# EAGLE design drl (EAGLE 6.5.0)
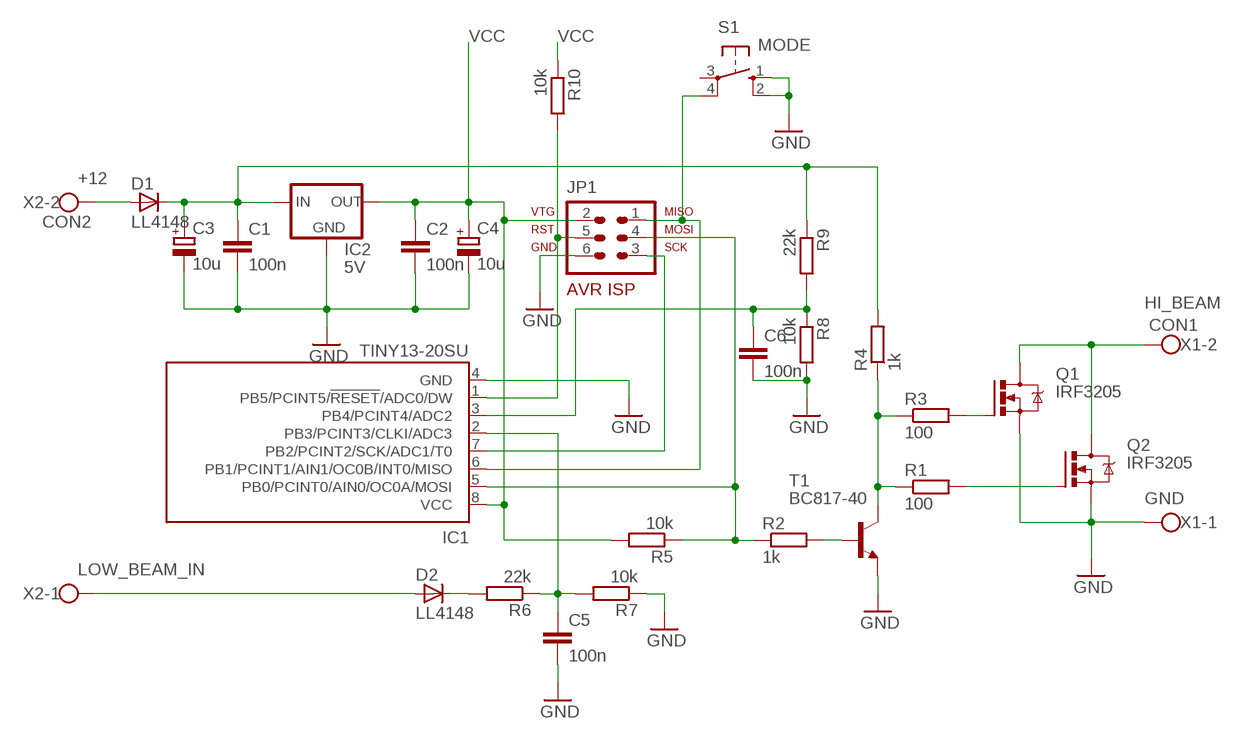
[diagram p0: schematic, sheet 1]

## Parts
C1  100n  C-EUC0805K  [C0805K]
C2  100n  C-EUC0805K  [C0805K]
C3  10u  CPOL-EUSMCD  [SMC_D]
C4  10u  CPOL-EUSMCD  [SMC_D]
C5  100n  C-EUC0805K  [C0805K]
C6  100n  C-EUC0805K  [C0805K]
D1  LL4148  D-SOD-80  [SOD80]
D2  LL4148  D-SOD-80  [SOD80]
IC1  TINY13-20SU  [8S2]
IC2  5V  UA78L05SOIC  [SOIC8]
JP1  AVR-ISP-6  [AVR-ISP-6]
Q1  IRF3205  [TO220BV]
Q2  IRF3205  [TO220BV]
R1  100  R-EU_R0805  [R0805]
R2  1k  R-EU_0204/7  [0204/7]
R3  100  R-EU_R0805  [R0805]
R4  1k  R-EU_R0805  [R0805]
R5  10k  R-EU_R0805  [R0805]
R6  22k  R-EU_R0805  [R0805]
R7  10k  R-EU_R0805  [R0805]
R8  10k  R-EU_R0805  [R0805]
R9  22k  R-EU_R0805  [R0805]
R10  10k  R-EU_R0805  [R0805]
S1  MODE  10-XX  [B3F-10XX]
T1  BC817-40  BC817-40-NPN-SOT23-BEC  [SOT23-BEC]
X1  CON1  W237-102  [W237-102]
X2  CON2  W237-102  [W237-102]

## Nets
+12: D1.2(A) X2.2
GND: C1.2 C2.2 C3.- C4.- C5.2 C6.2 IC1.4(GND) IC2.2(GND) IC2.3(GND) IC2.6(GND) IC2.7(GND) JP1.6 Q1.S Q2.S R7.1 R8.2 S1.1(S) S1.2(S1) T1.E X1.1
HI_BEAM: Q1.D Q2.D X1.2
LOW_BEAM_IN: D2.2(A) X2.1
N$1: Q2.G R1.2
N$2: D2.1(C) R6.2
N$3: Q1.G R3.2
N$4: IC1.7(PB2/PCINT2/SCK/ADC1/T0) JP1.3
N$6: R2.2 T1.B
N$8: R1.1 R3.1 R4.1 T1.C
N$9: C5.1 IC1.2(PB3/PCINT3/CLKI/ADC3) R6.1 R7.2
N$10: IC1.1(PB5/PCINT5/!RESET!/ADC0/DW) JP1.5 R10.2
N$11: IC1.5(PB0/PCINT0/AIN0/OC0A/MOSI) JP1.4 R2.1 R5.1
N$12: IC1.6(PB1/PCINT1/AIN1/OC0B/INT0/MISO) JP1.1 S1.4(P1)
N$14: C6.1 IC1.3(PB4/PCINT4/ADC2) R8.1 R9.2
VCC: C2.1 C4.+ IC1.8(VCC) IC2.1(OUT) JP1.2 R5.2 R10.1
VCC12: C1.1 C3.+ D1.1(C) IC2.8(IN) R4.2 R9.1
Unconnected: S1.3(P)

## Library data of the parts
C1 C2 C5 C6 = resistor:C-EU: CAPACITOR, European symbol
C3 C4 = rcl:CPOL-EU: POLARIZED CAPACITOR, European symbol
D1 D2 = semicon-smd-ipc:D-: DIODE unfilled
IC1 = atmel:TINY13: 8-bit AVR Microcontroller with 1K Bytes In-System Programmable Flash Source: http://www.atmel.com/dyn/resources/prod_documents/2535S.pdf; MPN: ATTINY13-20SU; OC_FARNELL: 9171568; OC_NEWARK: 96K6522
IC2 = my_stuff:UA78L05: VOLTAGE REGULATOR
JP1 = atmel:AVR-ISP-6: AVR ISP-6 Serial Programming Header
Q1 Q2 = my_stuff:IRF3205: HEXFET Power MOSFET
R1-R10 = rcl:R-EU_: RESISTOR, European symbol
S1 = switch-omron:10-XX: OMRON SWITCH; MPN: B3F-1000; OC_FARNELL: 176432; OC_NEWARK: 36M3542
T1 = transistor:*-NPN-: NPN Transistror BF959 corrected 2008.03.06
X1 X2 = con-wago-500:W237-102: WAGO SCREW CLAMP; MPN: 237-102; OC_FARNELL: unknown; OC_NEWARK: 70K9898

## Board
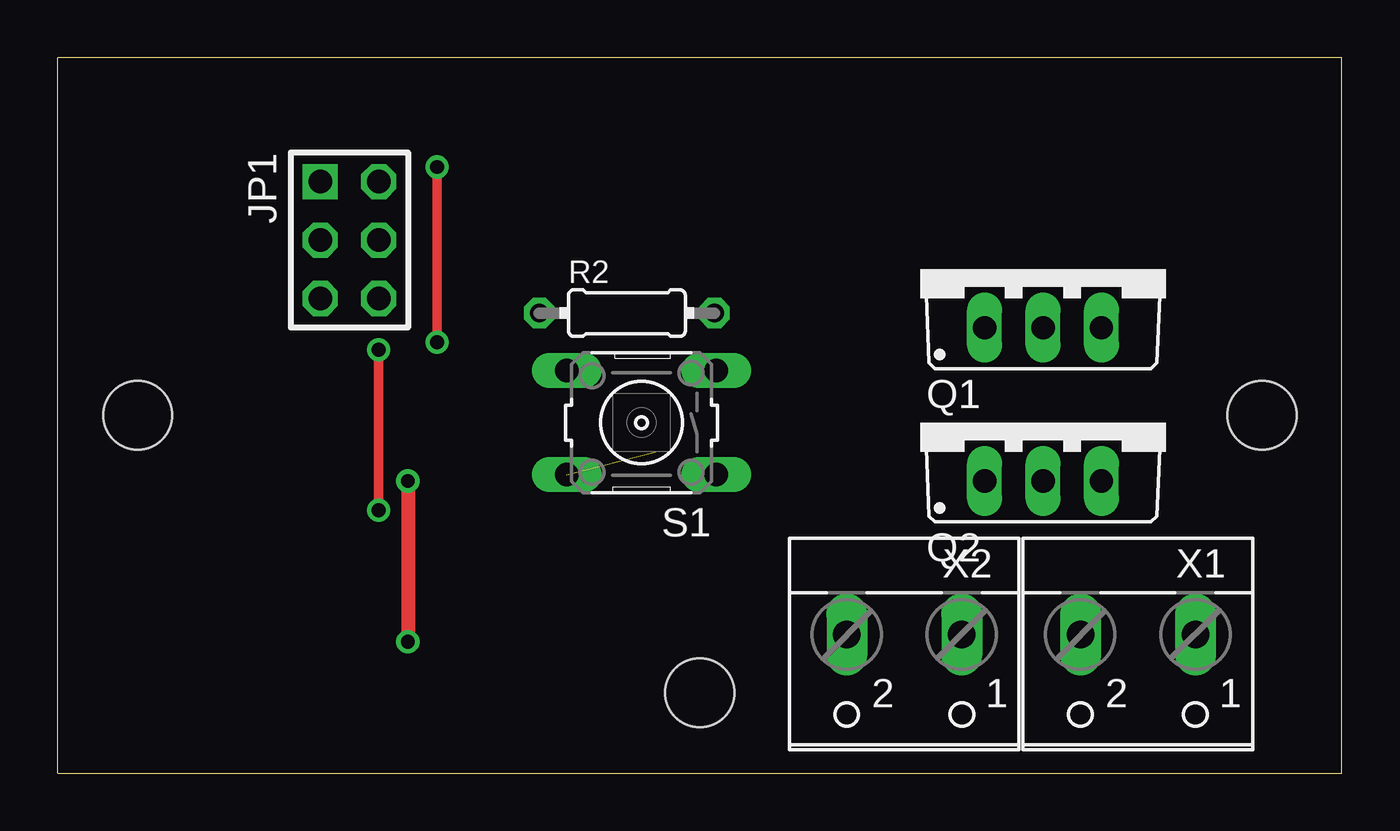
[diagram p1: board, top side]
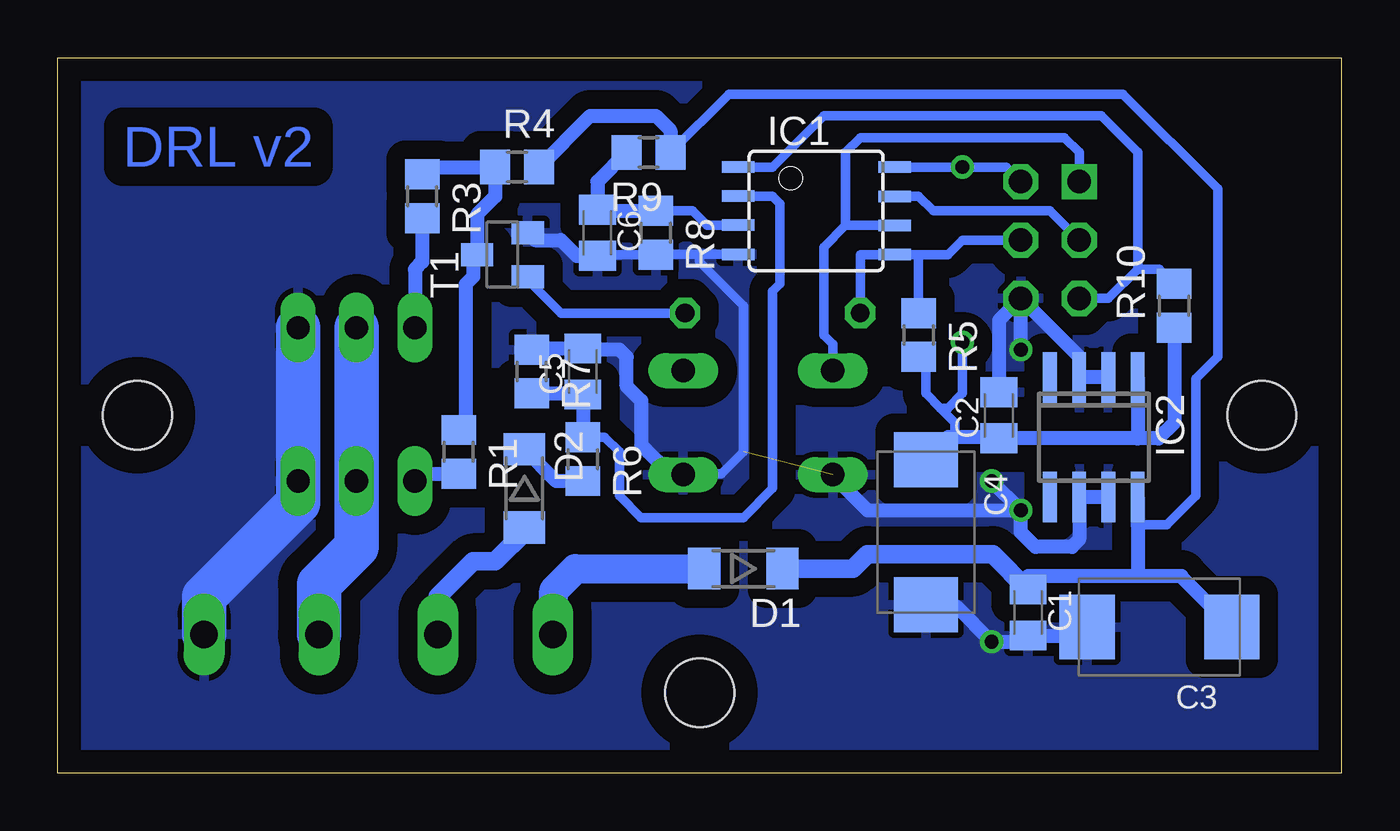
[diagram p2: board, bottom side, seen from below]

Size 55.87 x 31.11 mm. Coordinates in mm from the lower left corner, seen from the top.
Outline: 0,31.11 55.87,31.11 55.87,0 0,0 0,31.11
Copper layers (1*16): Top 0.035mm / dielectric 1.5mm / Bottom 0.035mm
Design rules "default": minimum track width 10mil, minimum drill 24mil, track to track 8mil, track to pad 8mil, pad to pad 8mil, via to via 8mil, smd to smd 8mil, copper to edge 40mil, drill to drill 8mil, minimum pad ring 10mil, minimum via ring 8mil, stop-mask expansion 4mil, vias tented up to drill 0mil, thermal gap 10mil
Holes 3 mm at 3.49,15.56 52.39,15.56 27.94,3.49

### Footprints (pad centres in the part's own frame; a part is rotated, then mirrored left to right if it is on the bottom)
C0805K = smd 1.3 x 1.6: 1 -1,0; 2 1,0
SMC_D = smd 2.4 x 2.8: + -3.15,0; - 3.15,0
SOD80 = smd 1.4 x 1.8: 1 -1.7,0; 2 1.7,0
8S2 = smd 0.5 x 1.4: 1 -1.905,-3.404; 2 -0.645,-3.404; 3 0.625,-3.404; 4 1.895,-3.404; 5 1.905,3.404; 6 0.635,3.404; 7 -0.635,3.404; 8 -1.905,3.404
SOIC8 = smd 0.6 x 2.2: 1 -1.905,-2.6; 2 -0.635,-2.6; 3 0.635,-2.6; 4 1.905,-2.6; 5 1.905,2.6; 6 0.635,2.6; 7 -0.635,2.6; 8 -1.905,2.6
AVR-ISP-6 = drill 1.016 square: 1 -2.54,-1.27 | drill 1.016 octagon: 2 -2.54,1.27; 3 0,-1.27; 4 0,1.27; 5 2.54,-1.27; 6 2.54,1.27
TO220BV = drill 1.016 long: D 0,-2.54; G -2.54,-2.54; S 2.54,-2.54
R0805 = smd 1.3 x 1.5: 1 -0.95,0; 2 0.95,0
0204/7 = drill 0.813 octagon: 1 -3.81,0; 2 3.81,0
B3F-10XX = drill 1.016 long: 1 -3.251,2.261; 2 3.251,2.261; 3 -3.251,-2.261; 4 3.251,-2.261
SOT23-BEC = smd 1 x 1.4: B -0.95,-1.1; C 0,1.1; E 0.95,-1.1
W237-102 = drill 1.194 long: 1 -2.5,-1.27; 2 2.5,-1.27

### Placement (x,y rotation side)
C1  13.65,6.99 270 bottom
C2  14.92,15.56 90 bottom
C3  7.94,6.35 180 bottom
C4  18.1,10.48 270 bottom
C5  33.02,17.46 90 bottom
C6  32.38,23.5 270 bottom
D1  26.04,8.89 180 bottom
D2  35.56,12.38 270 bottom
IC1  22.86,24.45 270 bottom
IC2  10.79,14.61 180 bottom
JP1  12.7,23.18 270 top
Q1  42.86,21.91 0 top
Q2  42.86,15.24 0 top
R1  38.42,13.97 270 bottom
R2  24.77,20 0 top
R3  40.01,25.08 270 bottom
R4  35.88,26.35 0 bottom
R5  18.41,19.05 270 bottom
R6  33.02,13.65 270 bottom
R7  35.24,17.46 270 bottom
R8  29.84,23.5 270 bottom
R9  30.16,26.99 180 bottom
R10  7.3,20.32 90 bottom
S1  25.4,15.24 180 top
T1  36.51,22.54 90 bottom
X1  46.99,4.76 180 top
X2  36.83,4.76 180 top

### Tracks (layer width: path | path; a pad name or v marks a point on that pad's centre or on a via)
+12
  Bottom 1.27: D1.2 33.34,8.89 34.29,7.94 34.29,6.07 X2.2
GND  (via drill 0.6)  (1 unrouted)
  Top 0.406: v13.97,11.43 v13.97,18.41
  Top 0.61: v15.24,12.7 v15.24,5.71
  Bottom 0.406: C6.2 32.34,22.55 R8.2 27.94,22.55 | 27.94,22.55 IC1.4 | S1.1 28.61,13.02 26.99,13.02 26.04,13.97 26.04,20.32 27.94,22.23 27.94,22.55
  Bottom 0.61: IC2.2 IC2.3 11.43,18.1 JP1.6 | JP1.6 14.92,19.68 C2.2 | T1.E 35.1,23.18 33.97,23.18 33.29,22.5 C6.2 | S1.1 29.17,12.98 30.48,14.29 30.48,16.19 31.11,16.83 31.11,18.1 31.43,18.41 32.97,18.41 C5.2 35.19,18.46 R7.1 | C4.- 18.02,7.26 16.78,7.26 v15.24,5.71 13.92,5.71 C1.2 11.45,5.98 C3.- | v13.97,11.43 v15.24,12.7 | IC2.7 IC2.6 11.43,10.16 11.75,9.84 13.34,9.84 13.97,10.48 v13.97,11.43 | v13.97,18.41 JP1.6 | S1.2 22.15,12.94 20.64,11.43 v13.97,11.43
  Bottom 1.93: Q1.S Q2.S 45.4,11.75 49.49,7.66 X1.1
  pour Bottom (isolate 0.813): 0,0 55.88,0 55.88,31.11 0,31.11
HI_BEAM
  Bottom 1.93: Q1.D Q2.D 42.86,9.84 44.49,8.21 X1.2
LOW_BEAM_IN
  Bottom 0.61: 35.52,10.64 D2.2
  Bottom 0.813: 35.52,10.64 35.52,10.52 36.83,9.21 37.78,9.21 39.33,7.66 X2.1
N$1
  Bottom 0.61: Q2.G 40,13.02 R1.2
N$2
  Bottom 0.61: R6.2 34.18,12.7 D2.1
N$3
  Bottom 0.61: R3.2 40.01,22.23 40.32,21.91 Q1.G
N$4
  Bottom 0.406: JP1.3 12.7,24.45 17.78,24.45 18.41,25.08 IC1.7
N$6
  Bottom 0.406: R2.2 33.97,20 35.41,21.44 T1.B
N$8
  Bottom 0.61: R1.1 38.1,15.24 38.1,21.27 37.78,21.59 37.78,22.37 T1.C 37.61,24.3 36.83,25.08 R4.1 39.69,26.35 R3.1
N$9
  Bottom 0.406: IC1.2 24.77,25.08 24.45,24.77 24.45,21.27 24.77,20.96 24.77,12.38 26.04,11.11 30.48,11.11 31.43,12.07 31.43,13.97 32.06,14.6 R6.1
  Bottom 0.61: R7.2 33.07,16.51 C5.1 R6.1
N$10
  Bottom 0.406: IC1.1 24.77,26.35 22.54,28.57 10.48,28.57 8.89,26.99 8.89,21.91 | 8.89,21.91 10.16,20.64 JP1.5 | R10.2 7.94,21.91 8.89,21.91
N$11
  Bottom 0.406: 18.41,22.54 IC1.5 20.95,22.54 R2.1 | 18.41,22.54 17.14,22.54 16.51,23.18 JP1.4 | R5.1 18.41,22.54
N$12
  Bottom 0.406: IC1.6 21.59,23.81 | 21.59,23.81 21.59,26.99 20.95,27.62 12.06,27.62 11.43,26.99 JP1.1 | 21.59,23.81 22.54,22.86 22.54,19.05 22.15,18.66 S1.4
N$14
  Bottom 0.406: IC1.3 26.27,23.81 27.62,23.81 28.25,24.45 R8.1
  Bottom 0.61: R9.2 32.38,25.71 C6.1 32.34,24.45 R8.1
VCC  (via drill 0.6)
  Top 0.406: v16.51,26.35 v16.51,18.73
  Bottom 0.406: R5.2 18.1,17.78 18.1,16.51 17.46,15.88 | 17.46,15.88 16.83,15.24 16.83,14.61 | IC1.8 v16.51,26.35 14.61,26.35 JP1.2 | v16.51,18.73 16.51,16.51 17.14,15.88 17.46,15.88
  Bottom 0.61: 8.89,14.56 7.99,14.56 7.3,15.24 R10.1 | 8.89,14.56 C2.1 14.97,14.61 16.83,14.61 17.12,14.61 C4.+ 18.1,13.34 | IC2.1 8.89,14.56
VCC12
  Bottom 0.406: R9.1 26.67,29.53 9.53,29.53 5.4,25.4 5.4,18.1 6.35,17.14 6.35,12.07 7.62,10.79 8.89,10.79
  Bottom 0.61: R4.2 32.7,28.57 29.84,28.57 29.21,27.94 R9.1 | C1.1 13.65,8.57 8.89,8.57 | 8.89,8.57 6.99,8.57 6.99,8.55 C3.+ | IC2.8 8.89,10.79 8.89,8.57
  Bottom 0.813: D1.1 21.27,8.89 20.64,9.53 15.19,9.53 C1.1

### Text on the board
Bottom: DRL v2